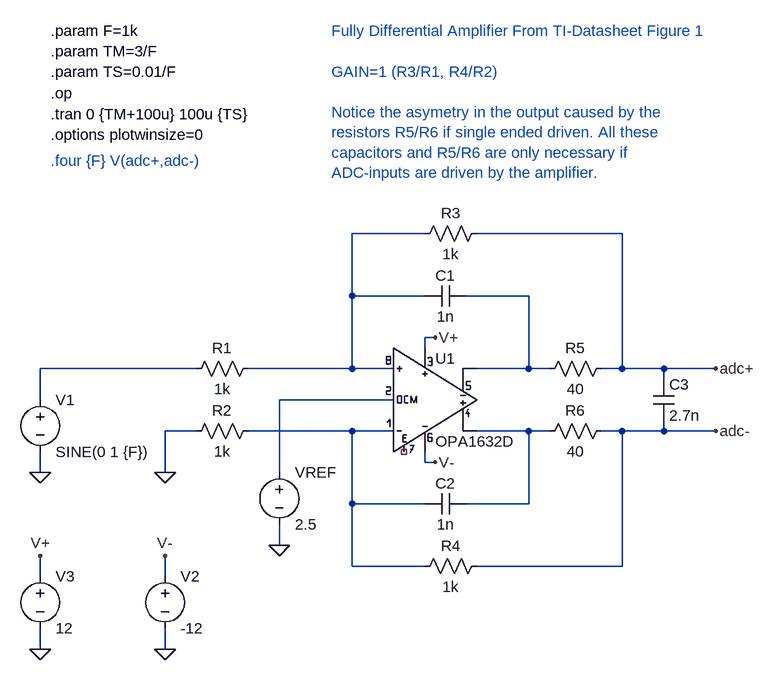
[diagram p0: schematic OPA1632_test.asc]
OPA1632_test.asc, the LTspice schematic file:
Version 4
SHEET 1 884 680
WIRE 144 -448 32 -448
WIRE 448 -448 224 -448
WIRE 32 -352 32 -448
WIRE 144 -352 32 -352
WIRE 304 -352 208 -352
WIRE 160 -288 144 -288
WIRE 144 -272 144 -288
WIRE -208 -240 -448 -240
WIRE 32 -240 32 -352
WIRE 32 -240 -128 -240
WIRE 96 -240 32 -240
WIRE 304 -240 304 -352
WIRE 304 -240 224 -240
WIRE 336 -240 304 -240
WIRE 448 -240 448 -448
WIRE 448 -240 416 -240
WIRE 512 -240 448 -240
WIRE 592 -240 512 -240
WIRE 512 -224 512 -240
WIRE -448 -192 -448 -240
WIRE 96 -192 -80 -192
WIRE -208 -144 -256 -144
WIRE 32 -144 -128 -144
WIRE 96 -144 32 -144
WIRE 304 -144 224 -144
WIRE 336 -144 304 -144
WIRE 448 -144 416 -144
WIRE 512 -144 512 -160
WIRE 512 -144 448 -144
WIRE 592 -144 512 -144
WIRE 144 -96 144 -112
WIRE 160 -96 144 -96
WIRE -448 -80 -448 -112
WIRE -256 -80 -256 -144
WIRE -80 -80 -80 -192
WIRE 32 -32 32 -144
WIRE 144 -32 32 -32
WIRE 304 -32 304 -144
WIRE 304 -32 208 -32
WIRE -80 32 -80 0
WIRE 32 64 32 -32
WIRE 144 64 32 64
WIRE 448 64 448 -144
WIRE 448 64 224 64
WIRE -448 80 -448 48
WIRE -256 80 -256 48
WIRE -448 192 -448 160
WIRE -256 192 -256 160
FLAG -80 32 0
FLAG 160 -288 V+
FLAG 160 -96 V-
FLAG 592 -240 adc+
FLAG 592 -144 adc-
FLAG -448 -80 0
FLAG -256 -80 0
FLAG -256 192 0
FLAG -448 192 0
FLAG -448 48 V+
FLAG -256 48 V-
SYMBOL res 128 -432 R270
WINDOW 0 32 56 VTop 0
WINDOW 3 0 56 VBottom 0
SYMATTR InstName R3
SYMATTR Value 1k
SYMBOL res 128 80 R270
WINDOW 0 32 56 VTop 0
WINDOW 3 0 56 VBottom 0
SYMATTR InstName R4
SYMATTR Value 1k
SYMBOL res -224 -128 R270
WINDOW 0 32 56 VTop 0
WINDOW 3 0 56 VBottom 0
SYMATTR InstName R2
SYMATTR Value 1k
SYMBOL res -224 -224 R270
WINDOW 0 32 56 VTop 0
WINDOW 3 0 56 VBottom 0
SYMATTR InstName R1
SYMATTR Value 1k
SYMBOL res 320 -128 R270
WINDOW 0 32 56 VTop 0
WINDOW 3 0 56 VBottom 0
SYMATTR InstName R6
SYMATTR Value 40
SYMBOL res 320 -224 R270
WINDOW 0 32 56 VTop 0
WINDOW 3 0 56 VBottom 0
SYMATTR InstName R5
SYMATTR Value 40
SYMBOL cap 144 -16 R270
WINDOW 0 32 32 VTop 0
WINDOW 3 0 32 VBottom 0
SYMATTR InstName C2
SYMATTR Value 1n
SYMBOL cap 144 -336 R270
WINDOW 0 32 32 VTop 0
WINDOW 3 0 32 VBottom 0
SYMATTR InstName C1
SYMATTR Value 1n
SYMBOL cap 496 -224 R0
SYMATTR InstName C3
SYMATTR Value 2.7n
SYMBOL voltage -448 -208 R0
WINDOW 123 0 0 Left 0
WINDOW 39 0 0 Left 0
SYMATTR InstName V1
SYMATTR Value SINE(0 1 {F})
SYMBOL voltage -80 -96 R0
SYMATTR InstName VREF
SYMATTR Value 2.5
SYMBOL voltage -256 64 R0
SYMATTR InstName V2
SYMATTR Value -12
SYMBOL voltage -448 64 R0
SYMATTR InstName V3
SYMATTR Value 12
SYMBOL OPA1632d 128 -256 R0
SYMATTR InstName U1
TEXT -432 -664 Left 0 !.op
TEXT -432 -632 Left 0 !.tran 0 {TM+100u} 100u {TS}
TEXT -432 -600 Left 0 !.options plotwinsize=0
TEXT -432 -760 Left 0 !.param F=1k\n.param TM=3/F\n.param TS=0.01/F
TEXT -432 -560 Left 0 ;.four {F} V(adc+,adc-)
TEXT 0 -760 Left 0 ;Fully Differential Amplifier From TI-Datasheet Figure 1\n \nGAIN=1 (R3/R1, R4/R2)\n \nNotice the asymetry in the output caused by the \nresistors R5/R6 if single ended driven. All these \ncapacitors and R5/R6 are only necessary if\nADC-inputs are driven by the amplifier.

The netlist it stands for:
* OPA1632_test.asc
R3 N001 adc+ 1k
R4 N005 adc- 1k
R2 0 N005 1k
R1 N003 N001 1k
R6 N006 adc- 40
R5 N002 adc+ 40
C2 N005 N006 1n
C1 N001 N002 1n
C3 adc+ adc- 2.7n
V1 N003 0 SINE(0 1 {F})
VREF N004 0 2.5
V2 V- 0 -12
V3 V+ 0 12
XU1 N005 N004 V+ N006 N002 V- NC_01 N001 OPA1632  ; pins IN- COM V+ OUT+ out- V- EN IN+
.op
.tran 0 {TM+100u} 100u {TS}
.options plotwinsize=0
.param F=1k
.param TM=3/F
.param TS=0.01/F
* .four {F} V(adc+,adc-)
* Fully Differential Amplifier From TI-Datasheet Figure 1
* GAIN=1 (R3/R1, R4/R2)
* Notice the asymetry in the output caused by the
* resistors R5/R6 if single ended driven. All these
* capacitors and R5/R6 are only necessary if
* ADC-inputs are driven by the amplifier.
.lib Opa1632.mod
.backanno
.end